# Altium schematic sheet IO_LED.SchDoc
size A4; SheetNumber: 13; SheetTotal: 13
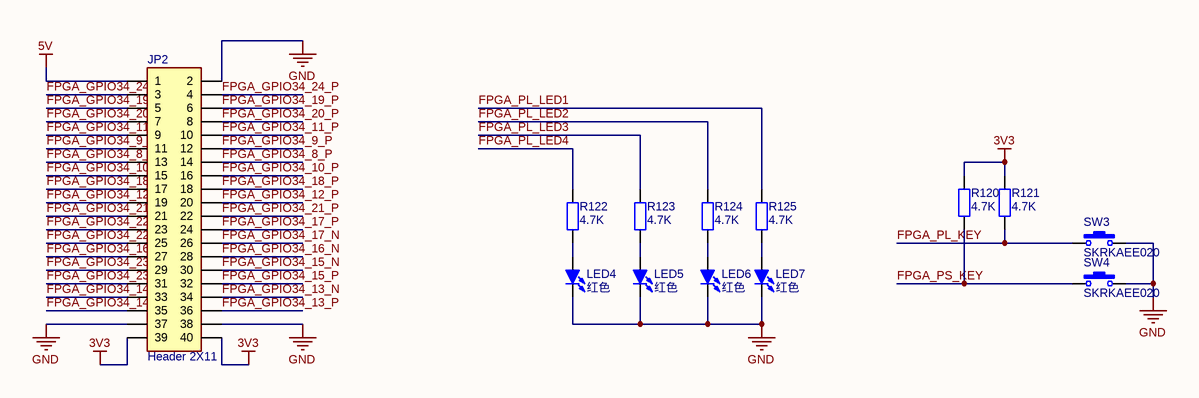
[diagram p0: IO_LED.SchDoc]

## Parts
JP2  Header 2X11  [IDC2.54-LI-2x20P]
LED4  红色  [LED 0805G]
LED5  红色  [LED 0805G]
LED6  红色  [LED 0805G]
LED7  红色  [LED 0805G]
R120  4.7K  [R 0402_L]
R121  4.7K  [R 0402_L]
R122  4.7K  [R 0402_L]
R123  4.7K  [R 0402_L]
R124  4.7K  [R 0402_L]
R125  4.7K  [R 0402_L]
SW3  SKRKAEE020  [SKRKAEE020]
SW4  SKRKAEE020  [SKRKAEE020]

## Nets
3V3: JP2.39 JP2.40 R120.2 R121.2
5V: JP2.1
GND: JP2.2 JP2.37 JP2.38 LED4.2(K) LED5.2(K) LED6.2(K) LED7.2(K) SW3.2 SW4.2
FPGA_GPIO34_8_N: JP2.13
FPGA_GPIO34_8_P: JP2.14
FPGA_GPIO34_9_N: JP2.11
FPGA_GPIO34_9_P: JP2.12
FPGA_GPIO34_10_N: JP2.15
FPGA_GPIO34_10_P: JP2.16
FPGA_GPIO34_11_N: JP2.9
FPGA_GPIO34_11_P: JP2.10
FPGA_GPIO34_12_N: JP2.19
FPGA_GPIO34_12_P: JP2.20
FPGA_GPIO34_13_N: JP2.34
FPGA_GPIO34_13_P: JP2.36
FPGA_GPIO34_14_N: JP2.33
FPGA_GPIO34_14_P: JP2.35
FPGA_GPIO34_15_N: JP2.30
FPGA_GPIO34_15_P: JP2.32
FPGA_GPIO34_16_N: JP2.28
FPGA_GPIO34_16_P: JP2.27
FPGA_GPIO34_17_N: JP2.26
FPGA_GPIO34_17_P: JP2.24
FPGA_GPIO34_18_N: JP2.17
FPGA_GPIO34_18_P: JP2.18
FPGA_GPIO34_19_N: JP2.5
FPGA_GPIO34_19_P: JP2.6
FPGA_GPIO34_20_N: JP2.7
FPGA_GPIO34_20_P: JP2.8
FPGA_GPIO34_21_N: JP2.21
FPGA_GPIO34_21_P: JP2.22
FPGA_GPIO34_22_N: JP2.25
FPGA_GPIO34_22_P: JP2.23
FPGA_GPIO34_23_N: JP2.31
FPGA_GPIO34_23_P: JP2.29
FPGA_GPIO34_24_N: JP2.3
FPGA_GPIO34_24_P: JP2.4
FPGA_PL_KEY: R121.1 SW3.1
FPGA_PL_LED1: R125.2
FPGA_PL_LED2: R124.2
FPGA_PL_LED3: R123.2
FPGA_PL_LED4: R122.2
FPGA_PS_KEY: R120.1 SW4.1
NetLED4_1: LED4.1(A) R122.1
NetLED5_1: LED5.1(A) R123.1
NetLED6_1: LED6.1(A) R124.1
NetLED7_1: LED7.1(A) R125.1

## Library data of the parts
JP2 = Header 20X2: 20*2P接插件; 版权归属: 源创客; BOM名称: 20*2P接插件; 学习资源: www.ooocke.com
LED4-LED7 = LED-SMD: 贴片LED; 版权归属: 源创客; BOM名称: 贴片LED; 学习资源: www.ooocke.com
R120-R125 = R: 贴片电阻; 版权归属: 源创客; BOM名称: 贴片电阻; 学习资源: www.ooocke.com
SW3 SW4 = SKRKAEE020: 2.9x3.9轻触开关; BOM名称: 3x6轻触开关; 联系卖家，免费查找封装: 唯一出售店铺网址https://shop463601444.taobao.com; 封装库来自淘宝卖家ID：黄晶宝石: 其他店铺购入的，请立即申请退款，本店现金奖励20~500元